# EasyEDA Pro project 无刷电机驱动板.epro, board PCB2
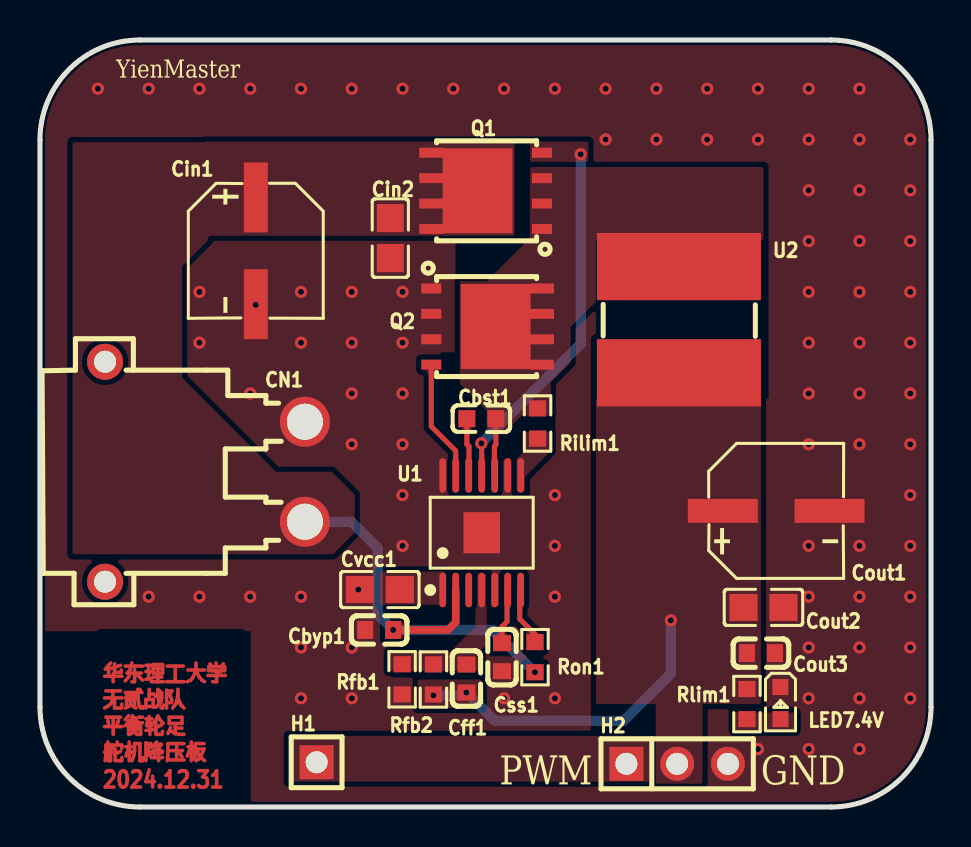
[diagram p7: board, top side]
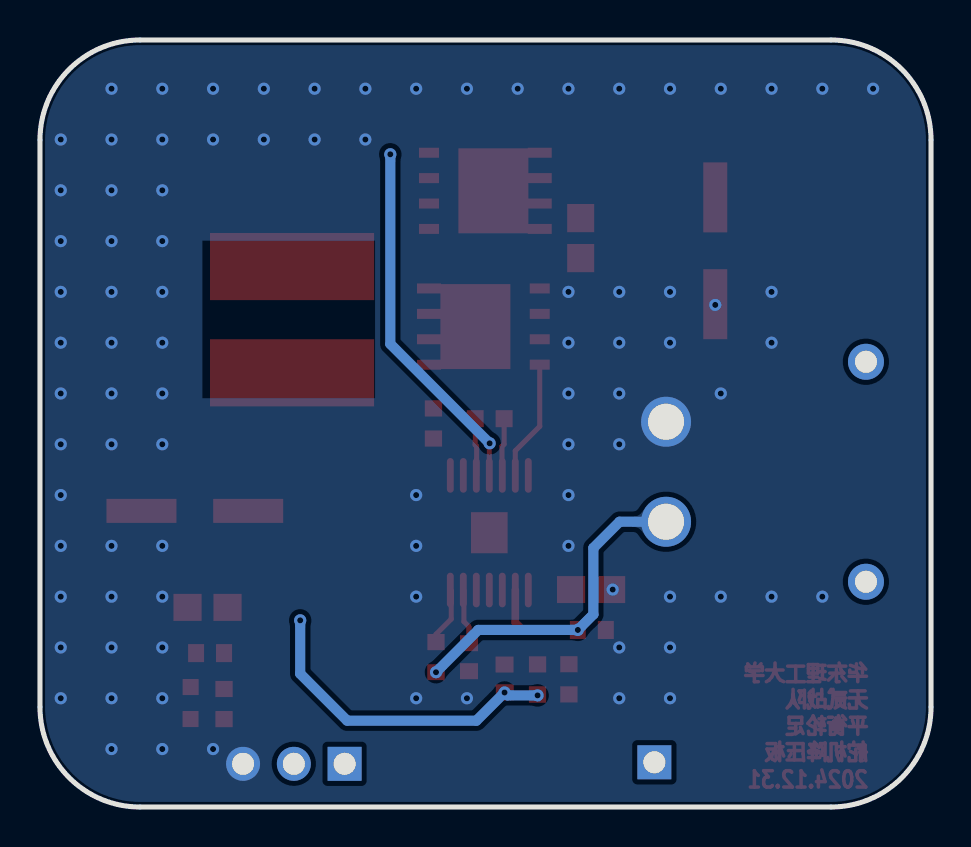
[diagram p8: board, bottom side, seen from below]

Outline 44.58 x 38.35 mm; copper layers: Top Layer, Bottom Layer. Coordinates in mm from the lower left corner of the outline.
Outline path: 0,33.35 0,5 arc(1.46,1.46) 5,0 39.58,0 arc(43.11,1.46) 44.58,5 44.58,33.35 arc(43.11,36.89) 39.58,38.35 5,38.35 arc(1.46,36.89) 0,33.35
Stack: Top Layer 0.035mm / Dielectric1 1.51mm FR4 er 4.5 / Bottom Layer 0.035mm

## Design rules (mm)
template: 自定义配置
spacing copperThickness1oz (default): track to track 0.102, other pairs 0.152 to 0.3
spacing copperThickness2oz: track to track 0.203, other pairs 0.152 to 0.3
track width copperThickness1oz (default): min 0.127, default 0.254, max 2.54
track width copperThickness2oz: min 0.203, default 0.254, max 2.54
differential pair differentialPair (default): width min 0.127, default 0.254, max 2.54; gap min 0.152, default 0.152
via viaSize (default): diameter min 0.5, default 0.61, max 10; hole min 0.3, default 0.305, max 6.3

## Placement (name value [footprint] x y rotation side)
Cbst1  470nF  [CAP-SMD_L1.6-W0.8-3]  22.08 19.42 180 top
Cbyp1  100nF  [C0603]  16.97 8.85 0 top
Cff1  270pF  [C0603]  21.33 6.43 270 top
Cin1  220uF  [CAP-SMD_BD6.3-L6.6-W6.6-LS7.4-FD]  10.8 27.81 270 top
Cin2  10uF  [C0805]  17.53 28.45 90 top
CN1  XT30PW-M30.G.Y  [CONN-TH_XT30PW-M]  8.26 16.76 270 top
Cout1  220uF  [CAP-SMD_BD6.3-L6.6-W6.6-LS7.4-FD]  36.83 14.81 0 top
Cout2  10uF  [C0805]  36.2 9.98 180 top
Cout3  100nF  [C0603]  36.07 7.69 180 top
Css1  15nF  [C0603]  23.11 7.49 90 top
Cvcc1  2.2uF  [C0805]  17 10.87 0 top
H1  PZ254V-11-01P  [HDR-TH_1P-P2.54-V-M]  13.84 2.24 0 top
H2  PZ254V-11-03P  [HDR-TH_3P-P2.54-V-M]  31.88 2.16 0 top
LED7.4V  -  [LED_0603]  37.05 5.15 270 top
Q1  TPH1R403NL  [DSOP-8_L5.0-W5.0-P1.27-LS6.0-BL-EP]  22.35 30.81 90 top
Q2  TPH1R403NL  [DSOP-8_L5.0-W5.0-P1.27-LS6.0-BL-EP]  22.35 24.02 270 top
Rfb1  10kΩ  [R0603]  18.12 6.38 90 top
Rfb2  113kΩ  [R0603]  19.68 6.38 270 top
Rilim1  1.37kΩ  [R0603]  24.89 19.18 90 top
Rlim1  2.8kΩ  [R0603]  35.37 5.15 90 top
Ron1  267kΩ  [R0603]  24.77 7.49 90 top
U1  LM3150MHX/NOPB  [HTSSOP-14_L5.0-W4.4-P0.65-LS6.4-BL-EP]  22.1 13.72 0 top
U2  3.3uH  [IND-SMD_L7.8-W7.6]  31.97 24.37 90 top

## Footprints (pads in the part's own frame, mm; a bottom-side part is the same pattern mirrored in y, then rotated)
C0603
  rect 0.8x0.9 smd: 1(-0.7,0) 2(0.7,0)
C0805
  rect 1.41x1.35 smd: 1(-1,0) 2(1,0)
CAP-SMD_BD6.3-L6.6-W6.6-LS7.4-FD
  rect 3.5x1.2 smd: 1(-2.67,0) 2(2.67,0)
CAP-SMD_L1.6-W0.8-3
  rect 0.85x0.85 smd: 1(-0.725,0) 2(0.725,0)
CONN-TH_XT30PW-M
  round 2.5 hole 1.8: 1(-2.5,5) 2(2.5,5)
  round 1.8 hole 1.1: 3(5.5,-5) 4(-5.5,-5)
DSOP-8_L5.0-W5.0-P1.27-LS6.0-BL-EP
  rect 0.5x1 smd: 1(-1.905,-2.77) 2(-0.635,-2.77) 3(0.634,-2.77) 4(1.905,-2.77)
  rect 0.5x1.2 smd: 5(1.905,2.77) 6(0.635,2.77) 7(-0.634,2.77) 8(-1.905,2.77)
  custom 4.25x3.5 smd: 9(0,0.45)
HDR-TH_1P-P2.54-V-M
  rect 1.7x1.7 hole 1.1: 1(0,0)
HDR-TH_3P-P2.54-V-M
  rect 1.7x1.7 hole 1.1: 1(-2.54,0)
  round 1.7 hole 1.1: 2(0,0) 3(2.54,0)
HTSSOP-14_L5.0-W4.4-P0.65-LS6.4-BL-EP
  oval 0.343x1.732 smd: 1(-1.95,-2.866) 2(-1.3,-2.866) 3(-0.65,-2.866) 4(0,-2.866) 5(0.65,-2.866) 6(1.3,-2.866) 7(1.95,-2.866) 8(1.95,2.866) 9(1.3,2.866) 10(0.65,2.866) 11(0,2.866) 12(-0.65,2.866) 13(-1.3,2.866) 14(-1.95,2.866)
  rect 1.83x2.055 smd: 15(0,0)
IND-SMD_L7.8-W7.6
  rect 3.36x8.208 smd: 1(2.655,0) 2(-2.655,0)
LED_0603
  rect 0.8x0.8 smd: 1(-0.851,-0.01) 2(0.75,-0.005)
R0603
  rect 0.806x0.864 smd: 1(-0.753,0) 2(0.753,0)

## Nets
As in the schematic.

Pads without a net: CN1 3 4; U1 3

## Via types
v1: diameter 0.61, hole 0.305, Top Layer to Bottom Layer, 94 vias

## Routing (per net, layer and track width the routed paths; a pad name or vN(x,y) marks a point on that pad's centre or on a via; arc(x,y) is an arc through that point)
7.4V_1: length 16.2
  Bottom Layer w0.508: v1(31.56,9.33) 31.56,6.67 29.21,4.32 22.74,4.32 v1(21.33,5.73) 21.19,5.58 v1(19.68,5.58)
GND:
  vias: v1(2.9,35.92) v1(5.44,35.92) v1(5.44,10.52) v1(7.98,35.92) v1(7.98,25.76) v1(7.98,23.22) v1(7.98,10.52) v1(10.52,35.92) v1(10.52,20.68) v1(10.52,10.52) v1(10.8,25.11) v1(13.06,35.92) v1(13.06,25.76) v1(13.06,23.22) v1(13.06,10.52) v1(13.06,7.98) v1(13.06,5.44) v1(15.6,35.92) v1(15.6,25.76) v1(15.6,23.22) v1(15.6,20.68) v1(15.6,18.14) v1(15.6,7.98) v1(15.6,5.44) v1(15.93,10.87) v1(18.14,35.92) v1(18.14,25.76) v1(18.14,23.22) v1(18.14,20.68) v1(18.14,18.14) v1(18.14,15.6) v1(18.14,13.06) v1(20.68,35.92) v1(23.22,35.92) v1(23.22,5.44) v1(25.76,35.92) v1(25.76,15.6) v1(25.76,13.06) v1(25.76,10.52) v1(25.76,5.44) v1(28.3,35.92) v1(28.3,33.38) v1(30.84,35.92) v1(30.84,33.38) v1(33.38,35.92) v1(33.38,33.38) v1(35.92,35.92) v1(35.92,33.38) v1(35.92,2.9) v1(38.46,35.92) v1(38.46,33.38) v1(38.46,30.84) v1(38.46,28.3) v1(38.46,25.76) v1(38.46,23.22) v1(38.46,20.68) v1(38.46,18.14) v1(38.46,13.06) v1(38.46,10.52) v1(38.46,7.98) v1(38.46,5.44) v1(38.46,2.9) v1(41,35.92) v1(41,33.38) v1(41,30.84) v1(41,28.3) v1(41,25.76) v1(41,23.22) v1(41,20.68) v1(41,18.14) v1(41,13.06) v1(41,10.52) v1(41,7.98) v1(41,5.44) v1(41,2.9) v1(43.54,33.38) v1(43.54,30.84) v1(43.54,28.3) v1(43.54,25.76) v1(43.54,23.22) v1(43.54,20.68) v1(43.54,18.14) v1(43.54,15.6) v1(43.54,13.06) v1(43.54,10.52) v1(43.54,7.98) v1(43.54,5.44)
VIN: length 21.5
  Top Layer w0.381: v1(17.67,8.85) 20.41,8.85 20.8,9.24 U1.2
  Bottom Layer w0.508: v1(24.77,6.74) 22.65,8.85 v1(17.67,8.85) 16.89,9.63 16.89,12.95 15.58,14.26 CN1.2
LG_1: length 6
  Top Layer w0.254: 19.58,22.12 19.58,19.03 20.8,17.81 U1.13
$1N2026: length 2.9
  Top Layer w0.254: Cbst1.1 22.81,18.11 22.73,18.03 22.73,16.6 U1.10
$1N2028: length 2.9
  Top Layer w0.254: U1.12 21.46,16.6 21.46,18.03 21.36,18.14 Cbst1.2
$1N2031: length 18.1
  Top Layer w0.254: v1(22.08,18.19) 22.1,18.17 U1.11
  Bottom Layer w0.508: v1(22.08,18.19) 27.05,23.16 v1(27.05,32.64)
$1N2050: length 2.9
  Top Layer w0.254: Ron1.2 24.77,8.64 24,9.4 24,10.81 U1.7
$1N2054: length 2.8
  Top Layer w0.254: U1.6 23.37,10.82 23.37,9.27 23.11,9.02 Css1.2

## Copper pours and planes (outline as drawn; the poured copper is in the pictures)
7.4V_1 on Top Layer: 30.8,7.49 33.15,7.49 33.15,1.16 30.8,1.16
7.4V_1 on Top Layer: 18.9,6.38 22.1,6.38 22.1,4.95 18.9,4.95
7.4V_1 on Top Layer: 27.81,23.37 36.07,23.37 36.07,5.15 27.81,5.15
GND on Top Layer: -6.73,40.39 47.75,40.39 47.75,-7.75 -6.73,-7.75
GND on Top Layer: 8.64,28.32 20.19,28.32 20.19,22.86 8.64,22.86
GND on Bottom Layer: -5.33,42.67 46.86,42.67 46.86,-2.92 -5.33,-2.92
VIN on Top Layer: 8.64,33.25 1.63,33.25 1.63,12.64 14.67,12.64 15.75,13.72 15.75,15.62 14.61,16.76 11.81,16.76 7.11,21.46 7.11,27.04 8.64,28.57
VIN on Top Layer: 8.26,33.27 23.74,33.27 23.74,28.57 8.26,28.57
FB_1 on Top Layer: 17.46,6.81 22.05,6.81 22.05,7.82 22.35,8.13 22.35,11.68 21.78,11.68 21.78,9.02 20.51,7.75 17.46,7.75
PWM1 on Top Layer: 30.48,1.27 30.48,3.56 12.45,3.56 12.45,1.27
$1N2026 on Top Layer: 24.51,32 24.51,28.45 22.35,26.29 21,26.29 21,21.16 22.35,19.81 22.35,18.75 23.27,18.75 24.08,19.56 25.55,19.56 25.55,21.23 26.54,22.22 26.54,24 27.81,25.27 36.2,25.27 36.2,32
$1N2031 on Top Layer: 24.51,33.27 27.43,33.27 27.43,32.26 24.51,32.26
$1N2032 on Top Layer: 25.55,18.75 25.55,17.79 24.26,16.5 24.26,15.75 23.85,15.75 23.85,17.41 24.23,17.79 24.23,18.75
$1N2045 on Top Layer: 34.71,4.72 37.8,4.72 37.8,3.81 34.71,3.81
$1N2048 on Top Layer: 17,11.78 20.3,11.78 20.3,10.12 17,10.12

Small or netless copper shapes (teardrops, artwork), in the pictures only: 13 on Top Layer, 10 on Bottom Layer

## Text on the board
Top Layer: 华东理工大学 / 无贰战队 / 平衡轮足 / 舵机降压板 / 2024.12.31
Top Silkscreen Layer: YienMaster | PWM | GND
